# Altium schematic sheet connector.SchDoc
size A4
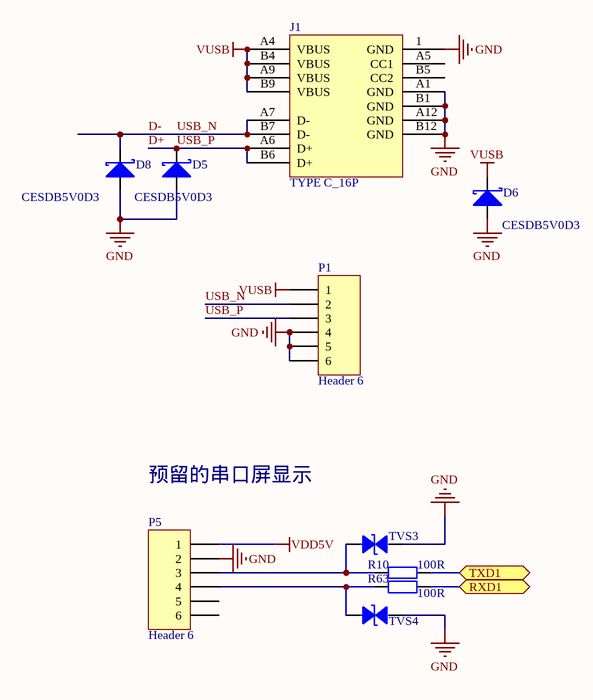
[diagram p0: connector.SchDoc]

## Parts
D5  CESDB5V0D3  [SOD323]
D6  CESDB5V0D3  [SOD323]
D8  CESDB5V0D3  [SOD323]
J1  TYPE C_16P  [TYPEC_16P]
P1  Header 6  [USB-A]
P5  Header 6  [6X2MMZ]
R10  100R  [0603R]
R63  100R  [0603R]
TVS3  ESD5Z5.0CT1G  [SOD-523]  (value not drawn)
TVS4  ESD5Z5.0CT1G  [SOD-523]  (value not drawn)

## Ports
RXD1 (bidir), TXD1 (bidir)

## Nets
GND: D5.1(A) D6.1(A) D8.1(A) J1.1(GND) J1.A1(GND) J1.A12(GND) J1.B1(GND) J1.B12(GND) P1.4 P1.5 P1.6 P5.2 TVS3.1(A) TVS4.1(A)
VDD5V: P5.1
VUSB: D6.2(K) J1.A4(VBUS) J1.A9(VBUS) J1.B4(VBUS) J1.B9(VBUS) P1.1
D+: D5.2(K) J1.A6(D+) J1.B6(D+) P1.3  [also labelled USB_P]
D-: D8.2(K) J1.A7(D-) J1.B7(D-) P1.2  [also labelled USB_N]
RXD1: R63.2 ; port RXD1
TXD1: R10.2 ; port TXD1
NetP5_3: P5.3 R10.1 TVS3.2(B)
NetP5_4: P5.4 R63.1 TVS4.2(B)

Not connected (* = marked no-connect by the designer): J1 A5(CC1) B5(CC2); P5 5 6

## Notes on the sheet
- 预留的串口屏显示

## Library data of the parts
D5 D6 D8 = DIODE S: Schottky Diode
P1 P5 = Header 6: Header, 6-Pin; LatestRevisionDate: 17-Jul-2002; LatestRevisionNote: Re-released for DXP Platform.; Publisher: Altium Limited
R10 R63 = RES2: 贴片电阻 5%
TVS3 TVS4 = TVS-1: TVS